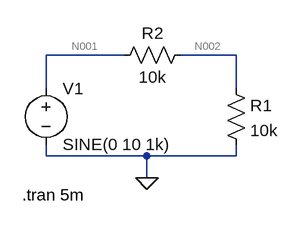
[diagram p0: schematic Lab1_part1.asc]
Lab1_part1.asc, the LTspice schematic file:
Version 4
SHEET 1 880 680
WIRE 192 96 80 96
WIRE 352 96 272 96
WIRE 80 144 80 96
WIRE 352 144 352 96
WIRE 80 240 80 224
WIRE 224 240 80 240
WIRE 352 240 352 224
WIRE 352 240 224 240
WIRE 224 272 224 240
FLAG 224 272 0
SYMBOL voltage 80 128 R0
WINDOW 123 0 0 Left 2
WINDOW 39 0 0 Left 2
SYMATTR InstName V1
SYMATTR Value SINE(0 10 1k)
SYMATTR Value2 ""
SYMATTR SpiceLine ""
SYMBOL res 336 128 R0
SYMATTR InstName R1
SYMATTR Value 10k
SYMATTR SpiceLine ""
SYMBOL res 176 112 R270
WINDOW 0 32 56 VTop 2
WINDOW 3 0 56 VBottom 2
SYMATTR InstName R2
SYMATTR Value 10k
TEXT 46 296 Left 2 !.tran 5m

The netlist it stands for:
* Lab1_part1.asc
V1 N001 0 SINE(0 10 1k)
R1 N002 0 10k
R2 N001 N002 10k
.tran 5m
.backanno
.end

* Results of the author's LTspice run, read from the files saved beside the schematic
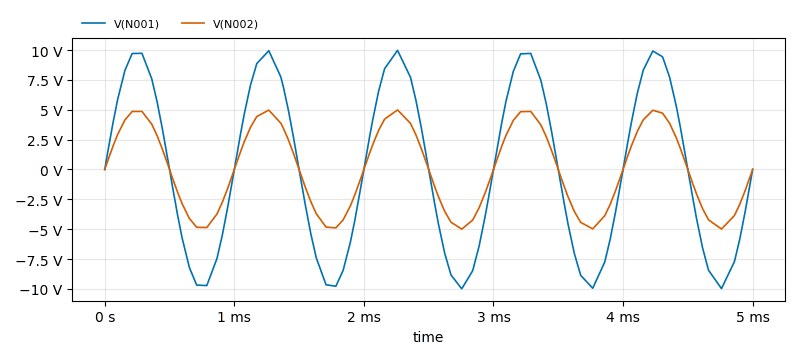
[diagram p1: Transient Analysis of Lab1_part1.asc, plotted from the saved traces]
* Transient Analysis, 1 run:
*   V(N001): min -9.987 V, max 9.969 V, average 2.07 mV, rms 6.981 V, last 0 V
*   V(N002): min -4.994 V, max 4.985 V, average 1.035 mV, rms 3.491 V, last 0 V